# EAGLE design 3PDT_Breakout (EAGLE 9.6.2)
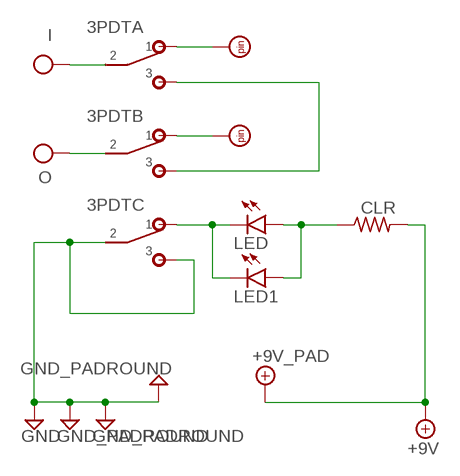
[diagram p0: schematic, sheet 1]

## Parts
3PDT  3PDT  [3PDT]
CI  PADS.SQR_NL  [PAD4]
CLR  RESISTORS.3B  [R0207/3]
CO  PADS.SQR_NL  [PAD4]
GI  GND_PADROUND  [ROUND]
GND  GND_PADROUND  [ROUND]
GO  GND_PADROUND  [ROUND]
I  IN  [SQUARE]
LED  LED3MM  [LED3MM]
LED1  LED3MM  [LED3MM]
O  OUT  [SQUARE]
V+  +9V_PAD  [SQUARE]

## Nets
+9V: CLR.2 V+.1(+9V)
GND: 3PDT.C2 3PDT.C3 GI.1(GND) GND.1(GND) GO.1(GND)
IN: 3PDT.A2 I.1(IN)
N$1: 3PDT.C1 LED1.K(C) LED.K(C)
N$2: CLR.1 LED1.A LED.A
N$3: 3PDT.B1 CO.P$1
N$4: 3PDT.A1 CI.P$1
N$5: 3PDT.A3 3PDT.B3
OUT: 3PDT.B2 O.1(OUT)

## Library data of the parts
3PDT = switches:3PDT: Mountain Switch 108-1M31T1B1M1QE-EVX https://www.mouser.com/ProductDetail/Mountain-Switch/108-1M31T1B1M1QE-EVX?qs=sGAEpiMZZMvudeGI7i40XO%252BnGhp8Hy%252BJe46O%2FBjy5XE%3D
CI CO = supply pins:PADS.: Pads For I/O connections or test point pads on PCBs.
CLR = resistors:RESISTORS
GI GND GO = supply pins:GND_PAD: Ground use this to hook up ground connections throughout a schematic instead of running wire automatically labels the net "GND"
I = supply pins:IN: Input obsolete: use Mark instead and label net schematic input label without circuit board terminal/pad labels net "IN" provided as complement to OUT (rarely used)
LED LED1 = diodes:LED
O = supply pins:OUT: Output obsolete: use Mark instead and label net output label without circuit board terminal/pad commonly used as output label on 2nd lug of a potentiometer
V+ = supply pins:+9V_PAD: +9V Voltage Supply use this to hook up +9v throughout a schematic instead of running wire automatically labels the net "+9v"

## Board
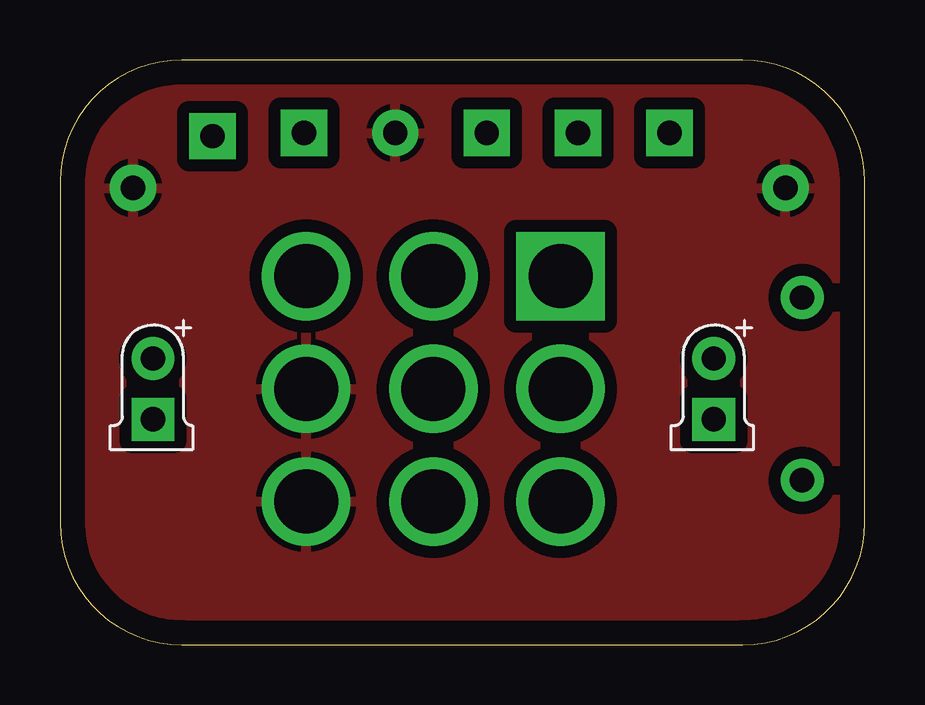
[diagram p1: board, top side]
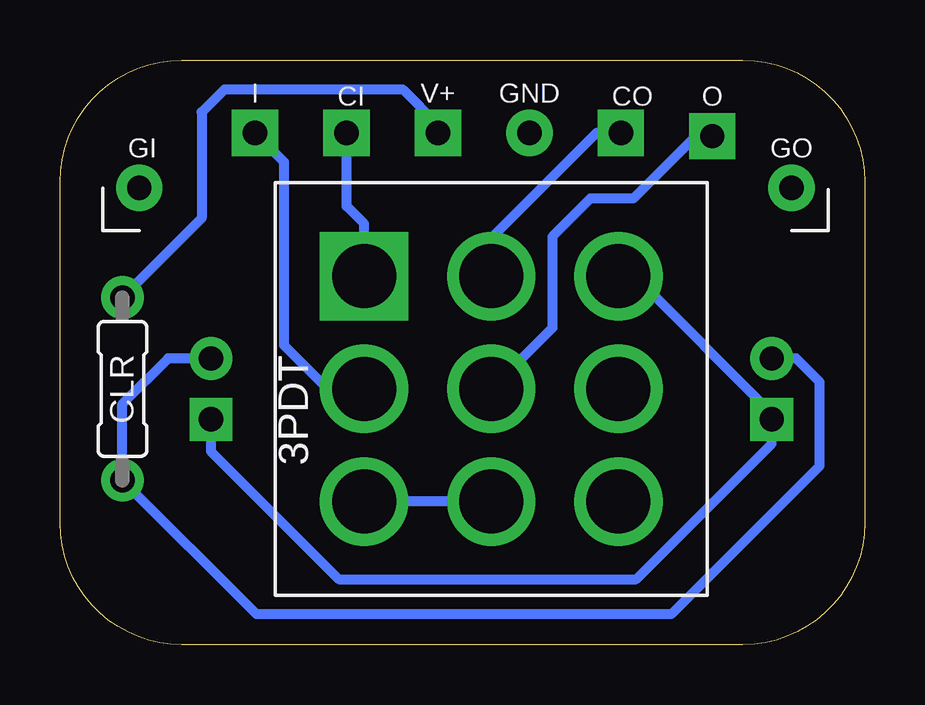
[diagram p2: board, bottom side, seen from below]

Size 33.53 x 24.38 mm. Coordinates in mm from the lower left corner, seen from the top.
Outline: 0,5.08 arc90 5.08,0 28.45,0 arc90 33.53,5.08 33.53,19.3 arc90 28.45,24.38 5.08,24.38 arc90 0,19.3 0,5.08
Copper layers (1*16): Top 0.035mm / dielectric 1.5mm / Bottom 0.035mm
Design rules "default *": minimum track width 6mil, minimum drill 0.35mm, track to track 6mil, track to pad 10mil, pad to pad 6mil, via to via 6mil, smd to smd 6mil, copper to edge 40mil, drill to drill 6mil, minimum pad ring 10mil, minimum via ring 8mil, stop-mask expansion 4mil, vias tented up to drill 0mil, thermal gap 10mil

### Footprints (pad centres in the part's own frame; a part is rotated, then mirrored left to right if it is on the bottom)
3PDT = drill 2.667 square: A1 -5.3,4.7 | drill 2.667: A2 -5.3,0; A3 -5.3,-4.7; B1 0,4.7; B2 0,0; B3 0,-4.7; C1 5.3,4.7; C2 5.3,0; C3 5.3,-4.7
PAD4 = drill 1.016 pad 1.93 square: P$1 0,0
R0207/3 = drill 1.016 pad 1.778: 1 -3.81,0; 2 3.81,0
ROUND = drill 1.016 pad 1.93: 1 0,0
SQUARE = drill 1.016 pad 1.93 square: 1 0,0
LED3MM = drill 1.016 pad 1.778: A -1.27,0 | drill 1.016 pad 1.778 square: K 1.27,0

### Placement (x,y rotation side)
3PDT  15.56,10.67 0 bottom
CI  21.59,21.34 0 top
CLR  30.92,10.67 90 bottom
CO  10.16,21.34 0 top
GI  30.23,19.05 0 bottom
GND  13.97,21.34 0 bottom
GO  3.05,19.05 0 bottom
I  25.4,21.34 0 bottom
LED  27.24,10.67 270 top
LED1  3.87,10.67 270 top
O  6.35,21.21 0 bottom
V+  17.78,21.34 0 bottom

### Tracks (layer width: path | path; a pad name or v marks a point on that pad's centre or on a via)
+9V
  Bottom 0.406: CLR.2 27.62,17.78 27.62,22.21 26.67,23.16 19.25,23.16 17.78,21.69 V+.1
GND
  pour Top (isolate 0.508): 7.11,24.38 28.45,24.38 arc-90 33.53,19.3 33.53,15.75 33.53,5.08 arc-90 28.45,0 15.24,0 5.08,0 arc-90 0,5.08 0,14.73 0,19.3 arc-90 5.08,24.38
IN
  Bottom 0.406: 3PDT.A2 22.38,10.67 24.19,12.48 24.19,20.13 I.1
N$1
  Bottom 0.406: 3PDT.C1 9.59,15.37 3.87,9.65 LED1.K 3.87,8.38 9.53,2.73 21.91,2.73 27.24,8.06 LED.K
N$2
  Bottom 0.406: LED.A 29.02,11.94 30.92,10.03 CLR.1 25.34,1.27 8.06,1.27 1.87,7.46 1.87,10.95 2.86,11.94 LED1.A
N$3
  Bottom 0.406: 3PDT.B1 15.56,16.95 11.18,21.34 CO.P$1
N$4
  Bottom 0.406: 3PDT.A1 20.86,17.55 21.59,18.29 CI.P$1
N$5
  Bottom 0.406: 3PDT.B3 3PDT.A3
OUT
  Bottom 0.406: O.1 7.05,21.21 9.65,18.61 11.43,18.61 13.02,17.02 13.02,13.21 3PDT.B2

### Text on the board
bNames: CO | CI